# Altium project Game_Consol.PrjPCB
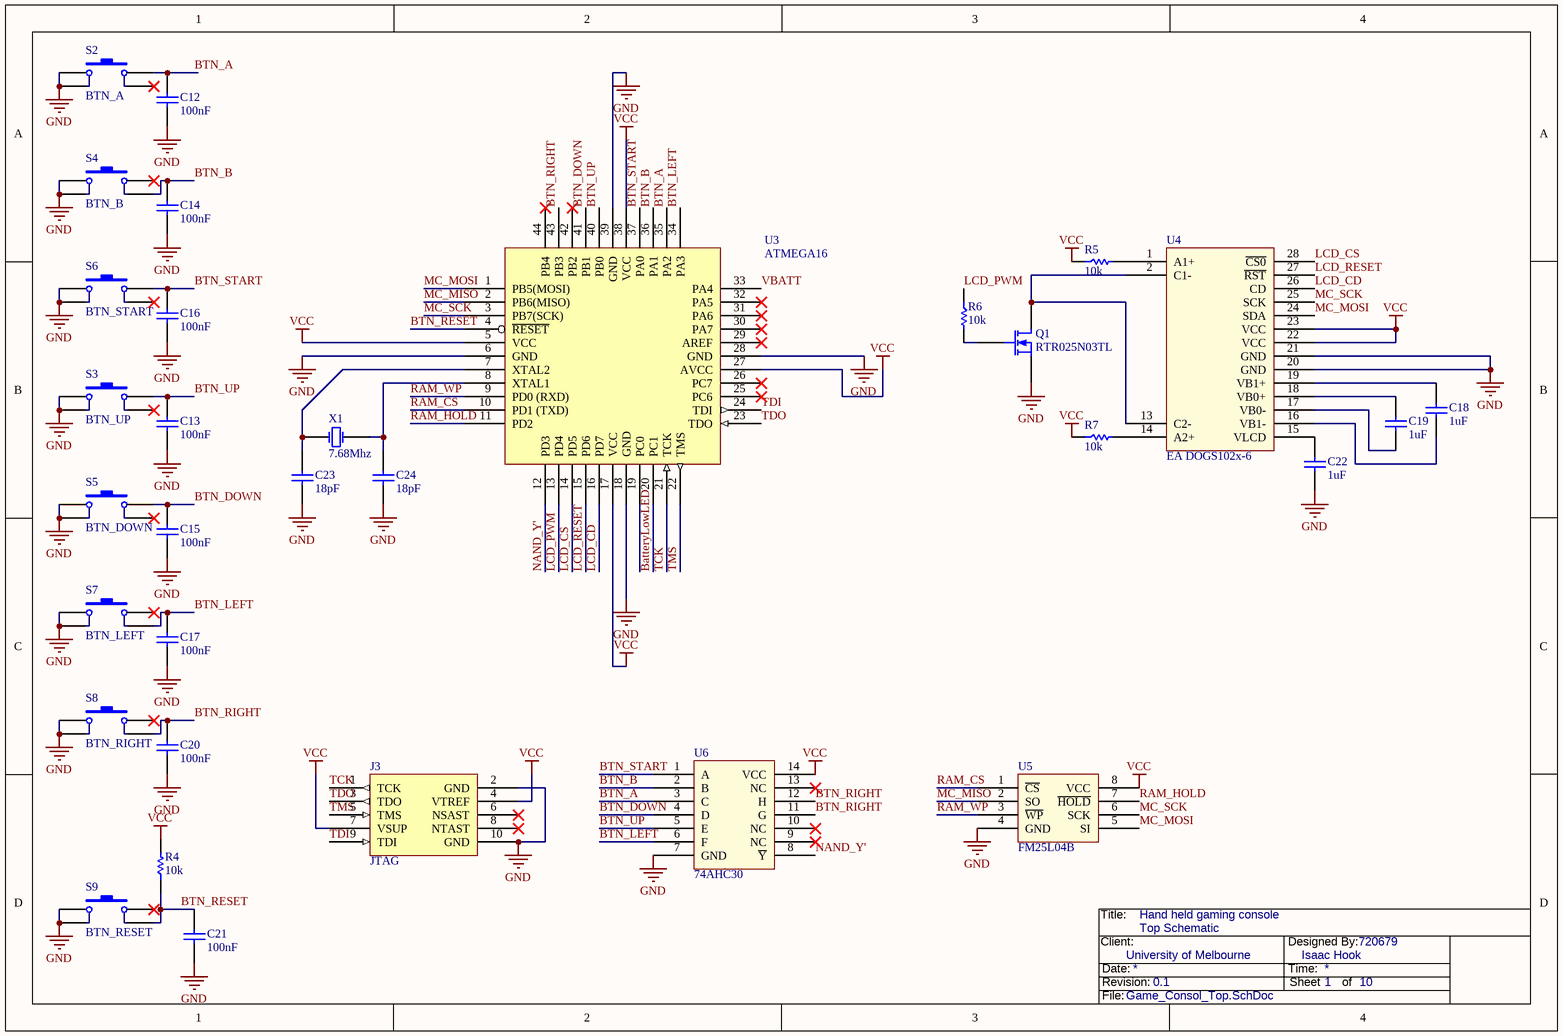
[diagram p0: Game_Consol_Top.SchDoc]

2 sheets, 55 parts. Net scope: global (net labels, ports and power ports of the same name join across sheets).
Board file: Game_Consol2.PcbDoc
Sheets:
  Game_Consol_Top.SchDoc
  Game_Consol_Power.SchDoc

## Sheet Game_Consol_Top.SchDoc: Top Schematic
size A4; CompanyName: University of Melbourne; DrawnBy: 720679; Engineer: Isaac Hook; Organization: University of Melbourne; DocumentNumber: 1; Revision: 0.1; SheetNumber: 1; SheetTotal: 10; Title_Project: Hand held gaming console

### Parts
C12  value 100nF  [0805]  (hidden comment: BTN_A)
C13  value 100nF  [0805]  (hidden comment: BTN_UP)
C14  value 100nF  [0805]  (hidden comment: BTN_B)
C15  value 100nF  [0805]  (hidden comment: BTN_DOWN)
C16  value 100nF  [0805]  (hidden comment: BTN_Start)
C17  value 100nF  [0805]  (hidden comment: BTN_LEFT)
C18  1uF  [0805]
C19  1uF  [0805]
C20  value 100nF  [0805]  (hidden comment: BTN_RIGHT)
C21  value 100nF  [0805]  (hidden comment: BTN_RESET)
C22  1uF  [0805]
C23  18pF  [0805]
C24  18pF  [0805]
J3  JTAG  [BOXEDVERT10]
Q1  RTR025N03TL  [SOT23]
R4  10k  [0805]
R5  10k  [0805]
R6  10k  [0805]
R7  10k  [0805]
S2  BTN_A  [SPNO_SMD]
S3  BTN_UP  [SPNO_SMD]
S4  BTN_B  [SPNO_SMD]
S5  BTN_DOWN  [SPNO_SMD]
S6  BTN_START  [SPNO_SMD]
S7  BTN_LEFT  [SPNO_SMD]
S8  BTN_RIGHT  [SPNO_SMD]
S9  BTN_RESET  [SPNO_SMD]
U3  ATMEGA16  [QFP-48]
U4  EA DOGS102x-6  [EA DOGS102x]
U5  FM25L04B  [SOIC-8]
U6  74AHC30  [SOIC-14]
X1  7.68Mhz  [XTAL_FLAT_SMD]

### Nets
GND: C12.2 C13.2 C14.2 C15.2 C16.2 C17.2 C20.2 C21.2 C22.2 C23.1 C24.1 J3.2(GND) J3.10(GND) Q1.2 S2.1 S2.2 S3.1 S3.2 S4.1 S4.2 S5.1 S5.2 S6.1 S6.2 S7.1 S7.2 S8.1 S8.2 S9.1 S9.2 U3.6(GND) U3.18(GND) U3.28(GND) U3.39(GND) U4.20(GND) U4.21(GND) U5.4(GND) U6.7(GND)
VBATT: U3.33(PA4)
VCC: J3.4(VTREF) J3.7(VSUP) R4.2 R5.1 R7.1 U3.5(VCC) U3.17(VCC) U3.27(AVCC) U3.38(VCC) U4.22(VCC) U4.23(VCC) U5.8(VCC) U6.14(VCC)
BatteryLowLED: U3.20(PC1)
BTN_A: C12.1 S2.3 U3.35(PA2) U6.3(C)
BTN_B: C14.1 S4.4 U3.36(PA1) U6.2(B)
BTN_DOWN: C15.1 S5.3 U3.41(PB1) U6.4(D)
BTN_LEFT: C17.1 S7.4 U3.34(PA3) U6.6(F)
BTN_RESET: C21.1 R4.1 S9.4 U3.4(~{RESET})
BTN_RIGHT: C20.1 S8.4 U3.43(PB3) U6.11(G) U6.12(H)
BTN_START: C16.1 S6.3 U3.37(PA0) U6.1(A)
BTN_UP: C13.1 S3.3 U3.40(PB0) U6.5(E)
LCD_CD: U3.16(PD7) U4.26(CD)
LCD_CS: U3.14(PD5) U4.28(~{CS0})
LCD_PWM: R6.1 U3.13(PD4)
LCD_RESET: U3.15(PD6) U4.27(~{RST})
MC_MISO: U3.2(PB6(MISO)) U5.2(SO)
MC_MOSI: U3.1(PB5(MOSI)) U4.24(SDA) U5.5(SI)
MC_SCK: U3.3(PB7(SCK)) U4.25(SCK) U5.6(SCK)
NAND_Y': U3.12(PD3) U6.8(~{Y})
RAM_CS: U3.10(PD1_(TXD)) U5.1(~{CS})
RAM_HOLD: U3.11(PD2) U5.7(~{HOLD})
RAM_WP: U3.9(PD0_(RXD)) U5.3(~{WP})
TCK: J3.1(TCK) U3.21(TCK)
TDI: J3.9(TDI) U3.24(TDI)
TDO: J3.3(TDO) U3.23(TDO)
TMS: J3.5(TMS) U3.22(TMS)
NetC18_1: C18.1 U4.16(VB1-)
NetC18_2: C18.2 U4.19(VB1+)
NetC19_1: C19.1 U4.18(VB0+)
NetC19_2: C19.2 U4.17(VB0-)
NetC22_1: C22.1 U4.15(VLCD)
NetC23_2: C23.2 U3.7(XTAL2) X1.1(OSC1)
NetC24_2: C24.2 U3.8(XTAL1) X1.2(OSC2)
NetQ1_1: Q1.1 R6.2
NetQ1_3: Q1.3 U4.2(C1-) U4.13(C2-)
NetR5_2: R5.2 U4.1(A1+)
NetR7_2: R7.2 U4.14(A2+)

Not connected (* = marked no-connect by the designer): J3 6(NSAST)* 8(NTAST)*; S2 4*; S3 4*; S4 3*; S5 4*; S6 4*; S7 3*; S8 3*; S9 3*; U3 19(PC0) 25(PC6)* 26(PC7)* 29(AREF)* 30(PA7)* 31(PA6)* 32(PA5)* 42(PB2)* 44(PB4)*; U4 3 4 5 6 7 8 9 10 11 12; U6 9(NC)* 10(NC)* 13(NC)*

### Notes on the sheet
- Title:
- Client:
- Date:
- Revision:
- Time:
- Designed By:
- Sheet
- of
- File:

### Library data of the parts
C12-C24 = C 0805: Capacitor 100nF; Class I: Passive; Revision: July-2002: Re-released for DXP Platform.
  C18 C19 C22: Value: 1uF
  C23 C24: Value: 18pF
J3 = JTAG_CON: JTAG ATMEL connector
Q1 = MOSFET-N: N-Channel MOSFET; PackageDocument: 1995/1996; Published: 8-Jun-2000; LatestRevisionDate: 17-Jul-2002; LatestRevisionNote: Re-released for DXP Platform.; PackageReference: E3; Publisher: Altium Limited
R4-R7 = R: Resistor; Value: 10k
S2-S9 = SW-PB: Push Button Switch; Manufacturer: TE Connectivity; Manufacturer Part Number: FSM4JSMA; Circuit: SPST-NO; Switch Function: Off-Mom; Contact Rating @ Voltage: 0.05A @ 12VDC; Actuator Type: Standard; Actuator Orientation: Top Actuated; Outline: 6.00mm x 6.00mm; Illumination: Non-Illuminated; Operating Force: 160gf; Published: 24-Mar-1999; LatestRevisionDate: 17-Jul-2002; LatestRevisionNote: Re-released for DXP Platform.; PackageReference: SPST-2; Publisher: Altium Limited; PackageDescription: Switch; 2 Leads; Supplier 1: Digi-Key; RoHS: RoHS Compliant; Category: Switches; Stock 1: 30338; Pricing 1: 1=0.28, 10=0.265, 25=0.2256, 50=0.1974, 100=0.1834, 250=0.1622, 500=0.15516, 1000=0.12694, 5000=0.10579 (AUD); Mounting Type: Surface Mount; Termination Style: Gull Wing; Packaging: Bulk; ComponentLink1URL: http://documents.tycoelectronics.com/commerce/DocumentDelivery/DDEController?Action=srchrtrv&DocNm=2-1437565-7&DocType=CD&DocLang=EN; ComponentLink1Description: http://documents.tycoelectronics.com/commerce/DocumentDelivery/DDEController?Action=srchrtrv&DocNm=2-1437565-7&DocType=CD&DocLang=EN; Supplier Part Number 1: 450-1129-ND
U3 = ATMEGA16: ATMEGA16 Microcontroller
U4 = EA DOGS102x-6: LCD 102x64-pixel with backlight
U5 = FM25L04B: FRAM 4Kb Memory
U6 = 74AHC30: 1 x 8 Input NAND gate
X1 = XTAL: Crystal Oscillator; Revision: July-2002: Re-released for DXP Platform.; Digikey: 535-9103-1-ND

## Sheet Game_Consol_Power.SchDoc: Power Schematic
size A4; CompanyName: University of Melbourne; DrawnBy: 720679; Engineer: Isaac Hook; Organization: University of Melbourne; DocumentNumber: 1; Revision: 0.1; SheetNumber: 1; SheetTotal: 10; Title_Project: Hand held gaming console
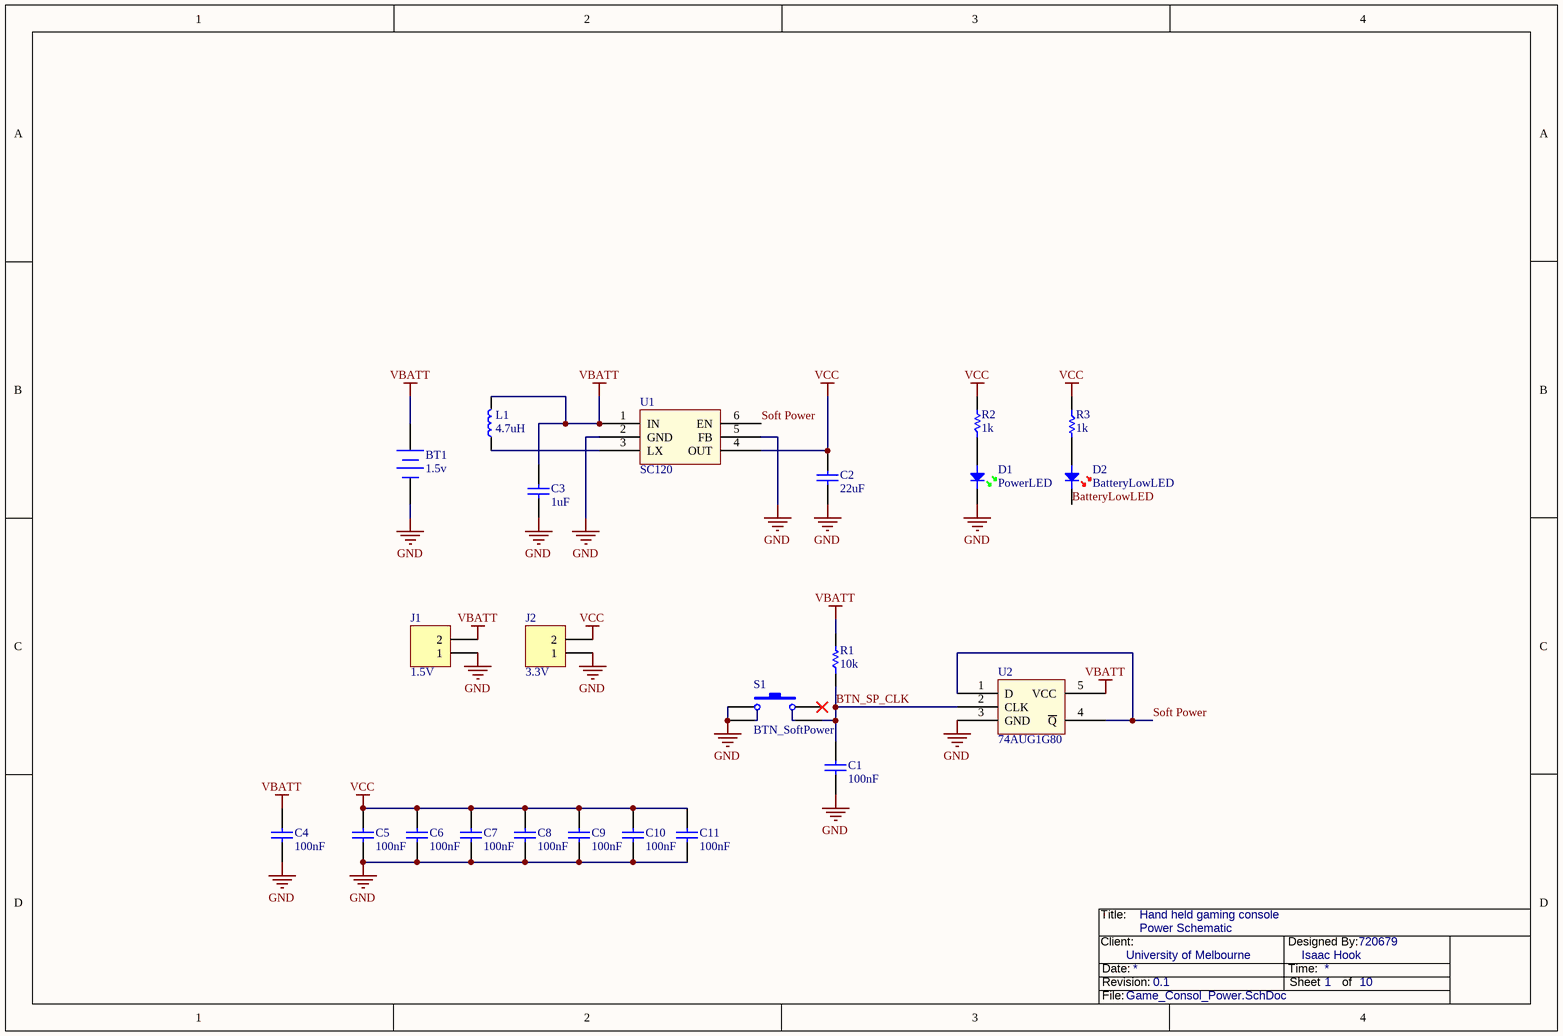
[diagram p1: Game_Consol_Power.SchDoc]

### Parts
BT1  1.5v  [BATT_HOLDER]
C1  100nF  [0805]
C2  22uF  [1210]
C3  1uF  [0805]
C4  100nF  [0805]
C5  100nF  [0805]
C6  100nF  [0805]
C7  100nF  [0805]
C8  100nF  [0805]
C9  100nF  [0805]
C10  100nF  [0805]
C11  100nF  [0805]
D1  PowerLED  [0805D]
D2  BatteryLowLED  [0805D]
J1  1.5V  [HDR1X2]
J2  3.3V  [HDR1X2]
L1  4.7uH  [1210L]
R1  10k  [0805]
R2  1k  [0805]
R3  1k  [0805]
S1  BTN_SoftPower  [SPNO_SMD]
U1  SC120  [SOT23-6]
U2  74AUG1G80  [SOT23-5]

### Nets
GND: BT1.2(-) C1.2 C2.2 C3.1 C4.2 C5.1 C6.1 C7.1 C8.1 C9.1 C10.1 C11.1 D1.K J1.1 J2.1 S1.1 S1.2 U1.2(GND) U1.5(FB) U2.3(GND)
VBATT: BT1.1(+) C3.2 C4.1 J1.2 L1.2 R1.2 U1.1(IN) U2.5(VCC)
VCC: C2.1 C5.2 C6.2 C7.2 C8.2 C9.2 C10.2 C11.2 J2.2 R2.2 R3.1 U1.4(OUT)
BatteryLowLED: D2.K
BTN_SP_CLK: C1.1 R1.1 S1.4 U2.2(CLK)
Soft Power: U1.6(EN) U2.1(D) U2.4(~{Q})
NetD1_A: D1.A R2.1
NetD2_A: D2.A R3.2
NetL1_1: L1.1 U1.3(LX)

Not connected (* = marked no-connect by the designer): S1 3*

### Notes on the sheet
- Title:
- Client:
- Date:
- Revision:
- Time:
- Designed By:
- Sheet
- of
- File:

### Library data of the parts
BT1 = BAT: Battery Holder AA 1.5v; Published: 24-Mar-1999; LatestRevisionDate: 17-Jul-2002; LatestRevisionNote: Re-released for DXP Platform.; PackageReference: BAT-2; Publisher: Altium Limited; PackageDescription: Battery; 2 Leads
C1 C3-C11 = C 0805: Capacitor 100nF; Class I: Passive; Revision: July-2002: Re-released for DXP Platform.
  C1 C4-C11: Value: 100nF
  C3: Value: 1uF
C2 = C 1210: Capacitor 22uF; Manufacturer: Generic Components; Manufacturer Part Number: LMK316F226ZL-T; Class I: Passive; Capacitance: 22µF; Voltage - Rated: 10V; Tolerance: -20%, +80%; Temperature Coefficient: Y5V (F); Published: 8-Jun-2000; Revision: July-2002: Re-released for DXP Platform.; Publisher: Altium Limited; Class II: Capacitor; Supplier 1: Digi-Key; RoHS: RoHS Compliant; Category: Capacitors; Stock 1: 33004; Pricing 1: 1=0.3, 10=0.254, 50=0.143, 100=0.1271, 250=0.09532, 500=0.08418, 1000=0.07465 (AUD); Mounting Type: Surface Mount, MLCC; Operating Temperature: -30°C ~ 85°C; Applications: General Purpose; Ratings: -; Package / Case: 1206 (3216 Metric); Size / Dimension: 0.126" L x 0.063" W (3.20mm x 1.60mm); Height - Seated (Max): -; Thickness (Max): 0.071" (1.80mm); Lead Spacing: -; Features: -; Packaging: Cut Tape (CT); Lead Style: -; ComponentLink1URL: http://www.yuden.co.jp/or/product/category/capacitor/LMK316F226ZL-T.pdf; ComponentLink1Description: http://www.yuden.co.jp/or/product/category/capacitor/LMK316F226ZL-T.pdf; Supplier Part Number 1: 587-1356-1-ND; Value: 22uF
D1 = LED GREEN: Light Emitting Diode; Manufacturer: Generic Components; Class I: Discrete; Class II: Diode - Switching; Published: 8-Jun-2000; Revision: July-2002: Re-released for DXP Platform.; Publisher: Altium Limited
D2 = LED RED: Light Emitting Diode; Manufacturer: Generic Components; Class I: Discrete; Class II: Diode - Switching; Published: 8-Jun-2000; Revision: July-2002: Re-released for DXP Platform.; Publisher: Altium Limited
J1 J2 = HDR2: 2 Pin Header; LatestRevisionDate: 17-Jul-2002; LatestRevisionNote: Re-released for DXP Platform.; Publisher: Altium Limited
L1 = I 1210: Inductor 4.7uH; Manufacturer: Murata Electronics North America; Manufacturer Part Number: LQH32CN4R7M23L; Code_IEC: 1005; Inductance: 4.7µH; Current: 450mA; Type: Ferrite Core; Tolerance: ±20%; Shielding: Unshielded; DC Resistance (DCR): 260 mOhm Max; Frequency - Self Resonant: 43MHz; Material - Core: Ferrite; Frequency - Test: 1MHz; Published: 8-Jun-2000; LatestRevisionDate: 17-Jul-2002; LatestRevisionNote: Re-released for DXP Platform.; PackageReference: 0402-A; Publisher: Altium Limited; Code_JEITA: 0402; Class II: Inductor; Supplier 1: Digi-Key; RoHS: RoHS Compliant; Category: Inductors, Coils, Chokes; Stock 1: 31057; Pricing 1: 1=0.34, 10=0.313, 25=0.2784, 50=0.2436, 100=0.2261, 250=0.20868, 500=0.19824, 750=0.18084, 1000=0.15998 (AUD); Current - Saturation: -; Current - Temperature Rise: -; Q @ Freq: -; Applications: Power Supplies; Package / Case: 1210 (3225 Metric); Mounting Type: Surface Mount; Packaging: Cut Tape (CT); Operating Temperature: -40°C ~ 85°C; ComponentLink1URL: http://search.murata.co.jp/Ceramy/image/img/PDF/ENG/L0075S0093LQH32C_23~33.pdf; ComponentLink1Description: http://search.murata.co.jp/Ceramy/image/img/PDF/ENG/L0075S0093LQH32C_23~33.pdf; Supplier Part Number 1: 490-2495-1-ND; Value: 4.7uH
R1-R3 = R: Resistor
  R1: Value: 10k
  R2 R3: Value: 1k
S1 = SW-PB: as S2 on sheet Game_Consol_Top; Published: 24-Mar-1999; LatestRevisionDate: 17-Jul-2002; LatestRevisionNote: Re-released for DXP Platform.; PackageReference: SPST-2; Publisher: Altium Limited; PackageDescription: Switch; 2 Leads; Supplier 1: Digi-Key; RoHS: RoHS Compliant; Category: Switches; Stock 1: 30338; Pricing 1: 1=0.28, 10=0.265, 25=0.2256, 50=0.1974, 100=0.1834, 250=0.1622, 500=0.15516, 1000=0.12694, 5000=0.10579 (AUD); Mounting Type: Surface Mount; Termination Style: Gull Wing; Packaging: Bulk; ComponentLink1URL: http://documents.tycoelectronics.com/commerce/DocumentDelivery/DDEController?Action=srchrtrv&DocNm=2-1437565-7&DocType=CD&DocLang=EN; ComponentLink1Description: http://documents.tycoelectronics.com/commerce/DocumentDelivery/DDEController?Action=srchrtrv&DocNm=2-1437565-7&DocType=CD&DocLang=EN; Supplier Part Number 1: 450-1129-ND
U1 = SC120: Regulator Low Voltage
U2 = 74AUG1G80: Inverted single D flip flop

## Nets that join several sheets
GND: Game_Consol_Top (38 pins), Game_Consol_Power (20 pins)
VBATT: Game_Consol_Top (U3.33), Game_Consol_Power (8 pins)
VCC: Game_Consol_Top (13 pins), Game_Consol_Power (12 pins)
BatteryLowLED: Game_Consol_Top (U3.20), Game_Consol_Power (D2.K)